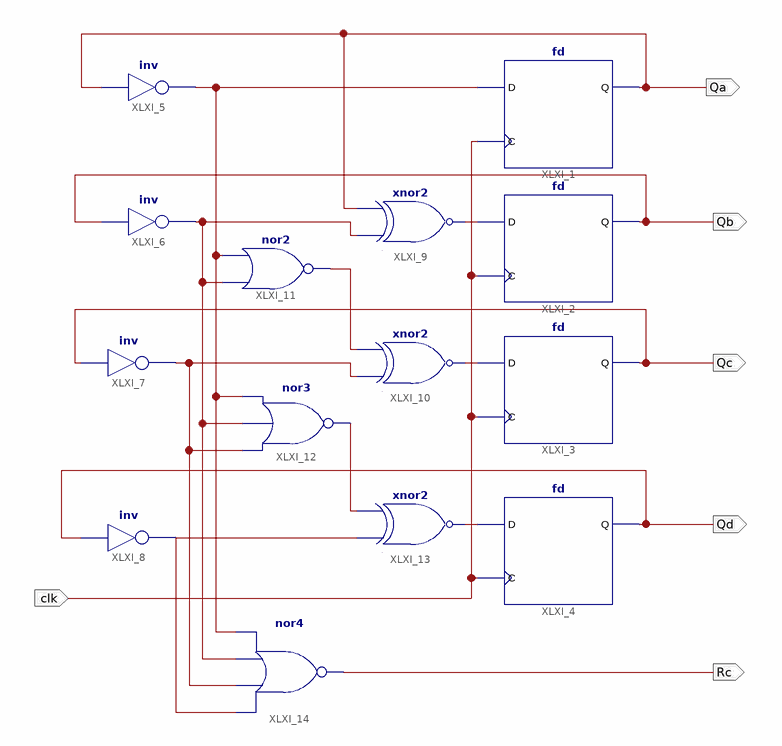
[diagram p0: schematic sheet 1]
// Xilinx ISE schematic Counter4b.sch (kintex7) as structural Verilog: 14 symbols, 6 ports
module Counter4b (
  input  clk,
  output Qa,
  output Qb,
  output Qc,
  output Qd,
  output Rc
);

  wire XLXN_11, XLXN_12, XLXN_13, XLXN_14, XLXN_20, XLXN_22, XLXN_26, XLXN_28, XLXN_29;

  fd XLXI_1 (.C(clk), .D(XLXN_11), .Q(Qa));
  fd XLXI_2 (.C(clk), .D(XLXN_12), .Q(Qb));
  fd XLXI_3 (.C(clk), .D(XLXN_14), .Q(Qc));
  fd XLXI_4 (.C(clk), .D(XLXN_26), .Q(Qd));
  not XLXI_5 (XLXN_11, Qa);
  not XLXI_6 (XLXN_13, Qb);
  not XLXI_7 (XLXN_22, Qc);
  not XLXI_8 (XLXN_29, Qd);
  xnor XLXI_9 (XLXN_12, XLXN_13, Qa);
  xnor XLXI_10 (XLXN_14, XLXN_22, XLXN_20);
  nor XLXI_11 (XLXN_20, XLXN_13, XLXN_11);
  nor XLXI_12 (XLXN_28, XLXN_22, XLXN_13, XLXN_11);
  xnor XLXI_13 (XLXN_26, XLXN_29, XLXN_28);
  nor XLXI_14 (Rc, XLXN_29, XLXN_22, XLXN_13, XLXN_11);
endmodule
